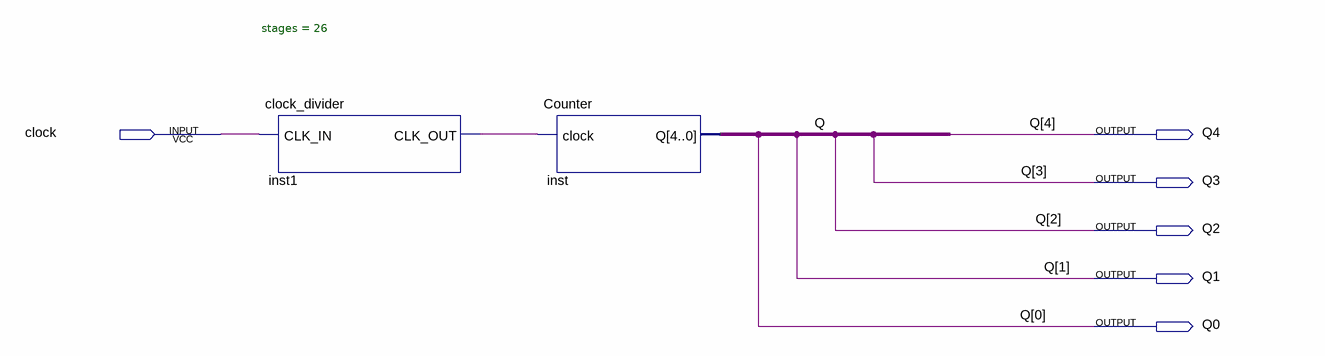
[diagram p0: schematic sheet]
// Quartus schematic CounterI.bdf as structural Verilog: 2 symbols, 6 pins
module CounterI (
  input  clock,
  output Q4,
  output Q3,
  output Q2,
  output Q1,
  output Q0
);

  wire inst1_clk_out, Q;

  clock_divider #(.stages(26)) inst1 (.CLK_IN(clock), .CLK_OUT(inst1_clk_out));
  Counter inst (.clock(inst1_clk_out), .Q(Q));
endmodule
